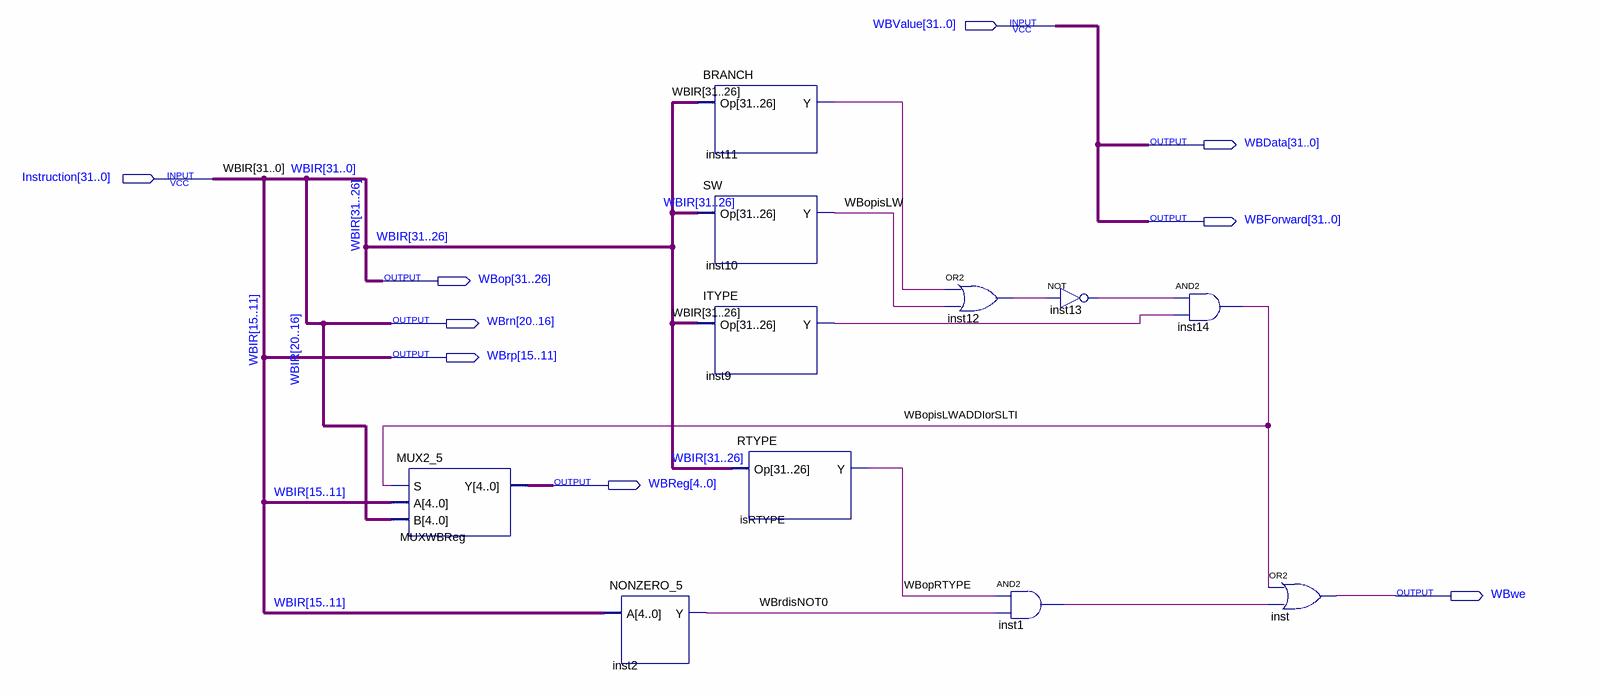
[diagram p0: schematic sheet]
// Quartus schematic WB.bdf as structural Verilog: 11 symbols, 9 pins
module WB (
  input  [31:0] WBValue,
  input  [31:0] Instruction,
  output [31:0] WBData,
  output [31:0] WBForward,
  output [31:26] WBop,
  output [20:16] WBrn,
  output [15:11] WBrp,
  output [4:0] WBReg,
  output WBwe
);

  wire inst1_out, inst9_y, inst11_y, inst12_out, inst13_out, WBopisLW, WBopisLWADDIorSLTI, WBopRTYPE,
       WBrdisNOT0;

  MUX2_5 MUXWBReg (.S(WBopisLWADDIorSLTI), .A(Instruction[15:11]), .B(Instruction[20:16]), .Y(WBReg));
  NONZERO_5 inst2 (.A(Instruction[15:11]), .Y(WBrdisNOT0));
  BRANCH inst11 (.Op(Instruction[31:26]), .Y(inst11_y));
  SW inst10 (.Op(Instruction[31:26]), .Y(WBopisLW));
  ITYPE inst9 (.Op(Instruction[31:26]), .Y(inst9_y));
  RTYPE isRTYPE (.Op(Instruction[31:26]), .Y(WBopRTYPE));
  or inst12 (inst12_out, inst11_y, WBopisLW);
  and inst1 (inst1_out, WBopRTYPE, WBrdisNOT0);
  not inst13 (inst13_out, inst12_out);
  and inst14 (WBopisLWADDIorSLTI, inst13_out, inst9_y);
  or inst (WBwe, WBopisLWADDIorSLTI, inst1_out);

  assign WBData = WBValue;
  assign WBForward = WBValue;
  assign WBop = Instruction[31:26];
  assign WBrn = Instruction[20:16];
  assign WBrp = Instruction[15:11];

  // Other names for the same wires on the sheet: WBIR[31:0] = Instruction
endmodule
